# Altium schematic sheet Indicators and Control.SchDoc
size Letter; SheetNumber: 4; SheetTotal: 4
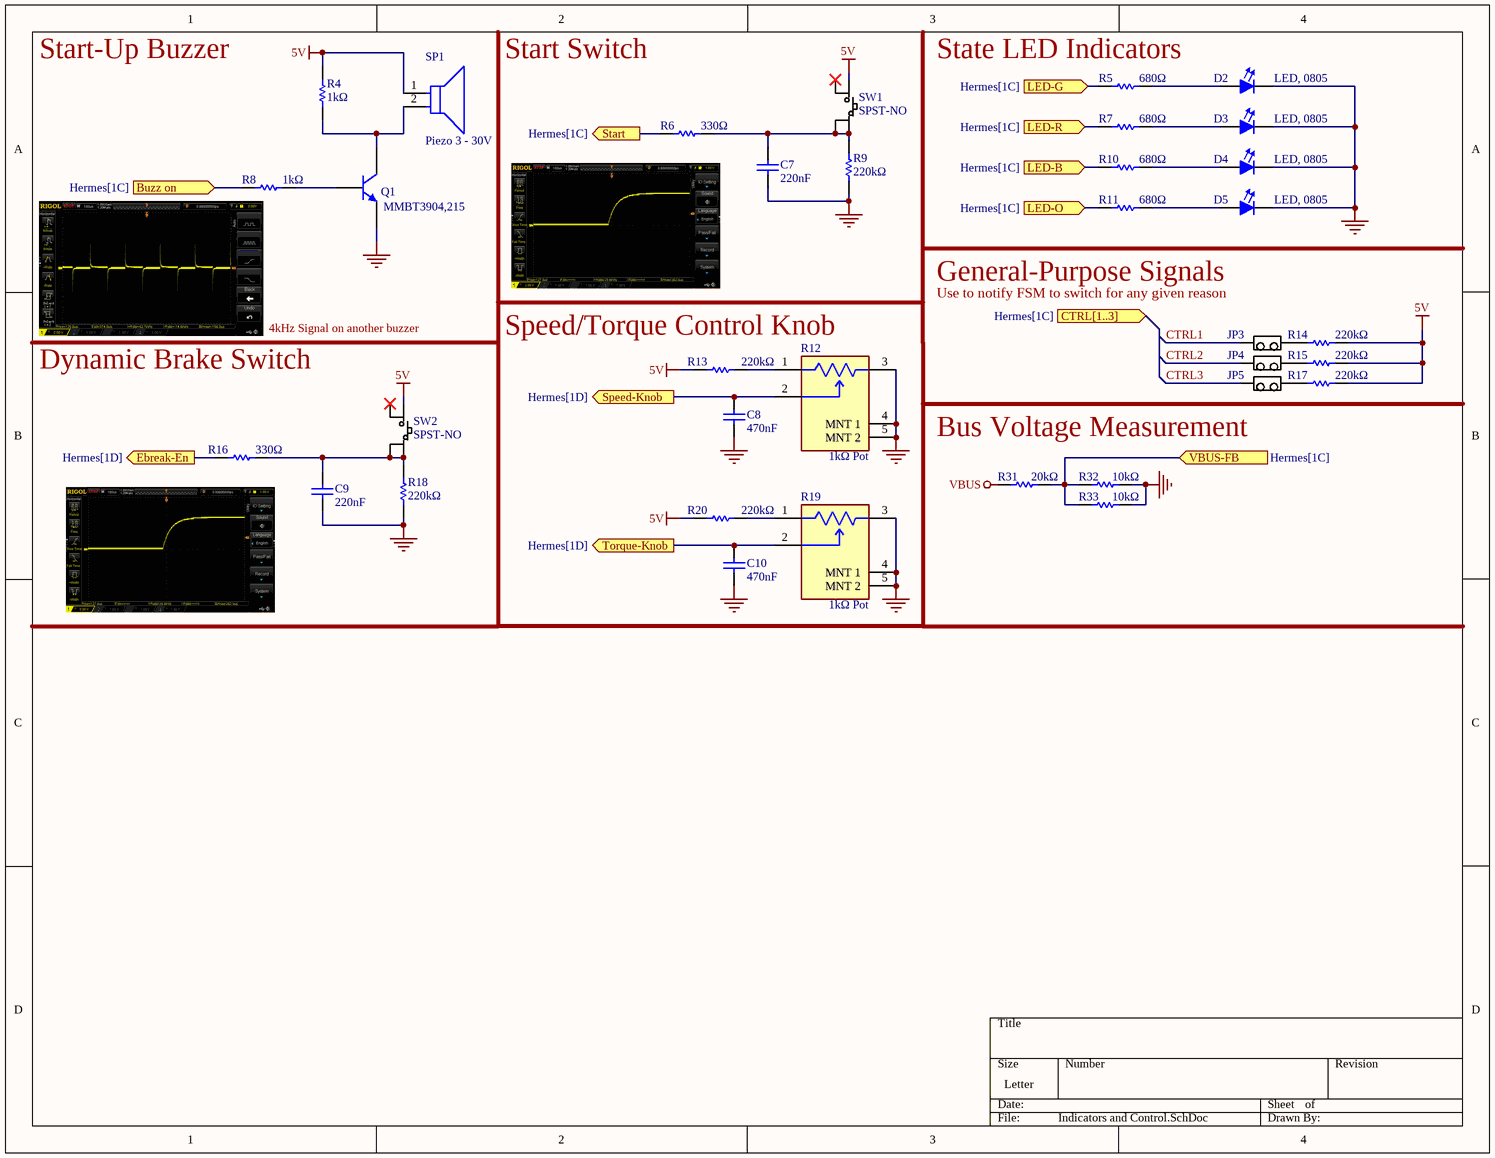
[diagram p0: Indicators and Control.SchDoc]

## Parts
C7  220nF  [CAP, 0603]
C8  470nF  [CAP, 0603]
C9  220nF  [CAP, 0603]
C10  470nF  [CAP, 0603]
D2  LED, 0805  [LED, 0805]
D3  LED, 0805  [LED, 0805]
D4  LED, 0805  [LED, 0805]
D5  LED, 0805  [LED, 0805]
JP3  0.1" Pitch  [1x2, Header]  (value not drawn)
JP4  0.1" Pitch  [1x2, Header]  (value not drawn)
JP5  0.1" Pitch  [1x2, Header]  (value not drawn)
Q1  MMBT3904,215  [SOT-23]
R4  1kΩ  [Res, 0603]
R5  680Ω  [Res, 0603]
R6  330Ω  [Res, 0603]
R7  680Ω  [Res, 0603]
R8  1kΩ  [Res, 0603]
R9  220kΩ  [Res, 0603]
R10  680Ω  [Res, 0603]
R11  680Ω  [Res, 0603]
R12  1kΩ Pot  [1k Pot]
R13  220kΩ  [Res, 0603]
R14  220kΩ  [Res, 0603]
R15  220kΩ  [Res, 0603]
R16  330Ω  [Res, 0603]
R17  220kΩ  [Res, 0603]
R18  220kΩ  [Res, 0603]
R19  1kΩ Pot  [1k Pot]
R20  220kΩ  [Res, 0603]
R31  20kΩ  [Res, 0603]
R32  10kΩ  [Res, 0603]
R33  10kΩ  [Res, 0603]
SP1  Piezo 3 - 30V  [FP-PKM13EPYH4000-A0-MFG]
SW1  SPST-NO  [4-SPST-NO]
SW2  SPST-NO  [4-SPST-NO]

## Ports
Buzz on (in, see Hermes[1C]), CTRL[1..3] (in, see Hermes[1C]), Ebreak-En (out, see Hermes[1D]), LED-B (in, see Hermes[1C]), LED-G (in, see Hermes[1C]), LED-O (in, see Hermes[1C]), LED-R (in, see Hermes[1C]), Speed-Knob (out, see Hermes[1D]), Start (out, see Hermes[1C]), Torque-Knob (out, see Hermes[1D]), VBUS-FB (in, see Hermes[1C])

## Nets
5V: R4.1 R13.1 R14.1 R15.1 R17.1 R20.1 SP1.1 SW1.4 SW2.4
GND: C7.2(Cathode) C8.2(Cathode) C9.2(Cathode) C10.2(Cathode) D2.1(Cathode) D3.1(Cathode) D4.1(Cathode) D5.1(Cathode) Q1.2(E) R9.1 R12.3 R12.4(MNT_1) R12.5(MNT_2) R18.1 R19.3 R19.4(MNT_1) R19.5(MNT_2) R32.1 R33.1
VBUS: R31.2
Buzz on: R8.1 ; port Buzz on
CTRL1: JP3.2
CTRL2: JP4.2
CTRL3: JP5.2
Ebreak-En: R16.2 ; port Ebreak-En
LED-B: R10.2 ; port LED-B
LED-G: R5.2 ; port LED-G
LED-O: R11.2 ; port LED-O
LED-R: R7.2 ; port LED-R
Speed-Knob: C8.1(Anode) R12.2 ; port Speed-Knob
Start: R6.2 ; port Start
Torque-Knob: C10.1(Anode) R19.2 ; port Torque-Knob
VBUS-FB: R31.1 R32.2 R33.2 ; port VBUS-FB
NetC7_1: C7.1(Anode) R6.1 R9.2 SW1.1 SW1.2
NetC9_1: C9.1(Anode) R16.1 R18.2 SW2.1 SW2.2
NetD2_2: D2.2(Anode) R5.1
NetD3_2: D3.2(Anode) R7.1
NetD4_2: D4.2(Anode) R10.1
NetD5_2: D5.2(Anode) R11.1
NetJP3_1: JP3.1 R14.2
NetJP4_1: JP4.1 R15.2
NetJP5_1: JP5.1 R17.2
NetQ1_1: Q1.1(B) R8.2
NetQ1_3: Q1.3(C) R4.2 SP1.2
NetR12_1: R12.1 R13.2
NetR19_1: R19.1 R20.2

Not connected (* = marked no-connect by the designer): SW1 3*; SW2 3*

## Notes on the sheet
- Start-Up Buzzer
- Start Switch
- State LED Indicators
- General-Purpose Signals
- Use to notify FSM to switch for any given reason
- Dynamic Brake Switch
- 4kHz Signal on another buzzer
- Speed/Torque Control Knob
- Bus Voltage Measurement

## Library data of the parts
C7-C10 = Cap, 0603
JP3-JP5 = 1x2 Pins: Supplier 1: Digi-Key; Supplier Part Number 1: 952-3073-ND
Q1 = CMP-052-0017-3: NPN, 40V/200mA, 250mW, SOT-23; Publisher: Andy Bates; PackageReference: TO-92A; Published: 8-Jun-2000; Design Item ID: MMBT3904,215; RoHS Compliant: Yes; Component Type: Standard; LatestRevisionDate: 09-Sep-2016; Source: AUVic_Schematic_Library_Transistors.SchLib; DatasheetVersion: 1997; Pin Count: 3
R4-R11 R13-R18 R20 R31-R33 = Res, 0603
SP1 = PS1240P02BT: Audio Buzzer Piezo 30Vo-p 3Vo-p 70dBA Through Hole Pin Ammo; Manufacturer: TDK; Frequency: 4kHz; Operating Supply Voltage: 3V; Supplier: Arrow Electronics; Supplier Part Number: PS1240P02BT; Manufacturer Part Number: PS1240P02BT; RoHS: Yes; Category: Audio Products; Stock: 8080; Pricing: 1=0.3736, 10=0.3379, 25=0.3346, 100=0.3094, 250=0.309, 500=0.2875, 1000=0.2797, 3000=0.266, 6000=0.26 (USD); Mounting Technology: Through Hole; Pins: 2; Min Operating Temperature: -10°C; Max Operating Temperature: 70°C; Package Quantity: 2500; Packaging: Tape and Reel; Termination: PC Pins; Voltage Rating (DC): 3V; Series: PS; Diameter: 12.2mm; Height: 6.5mm; Lead Free: Lead Free; RoHS Compliant: Yes; ComponentLink1URL: https://datasheet.ciiva.com/0/ef532-ps-112.pdf?src-supplier=Digi-Key; ComponentLink1Description: https://datasheet.ciiva.com/0/ef532-ps-112.pdf?src-supplier=Digi-Key; ComponentLink2URL: https://datasheet.ciiva.com/0/ef532-ps-111.pdf?src-supplier=Digi-Key; ComponentLink2Description: https://datasheet.ciiva.com/0/ef532-ps-111.pdf?src-supplier=Digi-Key; ComponentLink3URL: https://datasheet.ciiva.com/3306/ef532-ps-3306958.pdf?src-supplier=Avnet; ComponentLink3Description: https://datasheet.ciiva.com/3306/ef532-ps-3306958.pdf?src-supplier=Avnet; ComponentLink4URL: https://datasheet.ciiva.com/16225/ef532-ps-16225062.pdf?src-supplier=Onlinecomponents.com; ComponentLink4Description: https://datasheet.ciiva.com/16225/ef532-ps-16225062.pdf?src-supplier=Onlinecomponents.com; Supplier 1: Digi-Key; Supplier Part Number 1: 445-2525-1-ND
SW1 SW2 = Switch: SPST-NO Switch
R12 R19 = 1kΩ Pot: Supplier 1: Digi-Key; Supplier Part Number 1: PTV09A-4225F-B102-ND